# Altium schematic sheet Schematic - V1.SchDoc
size A3; SheetNumber: 1; SheetTotal: 2
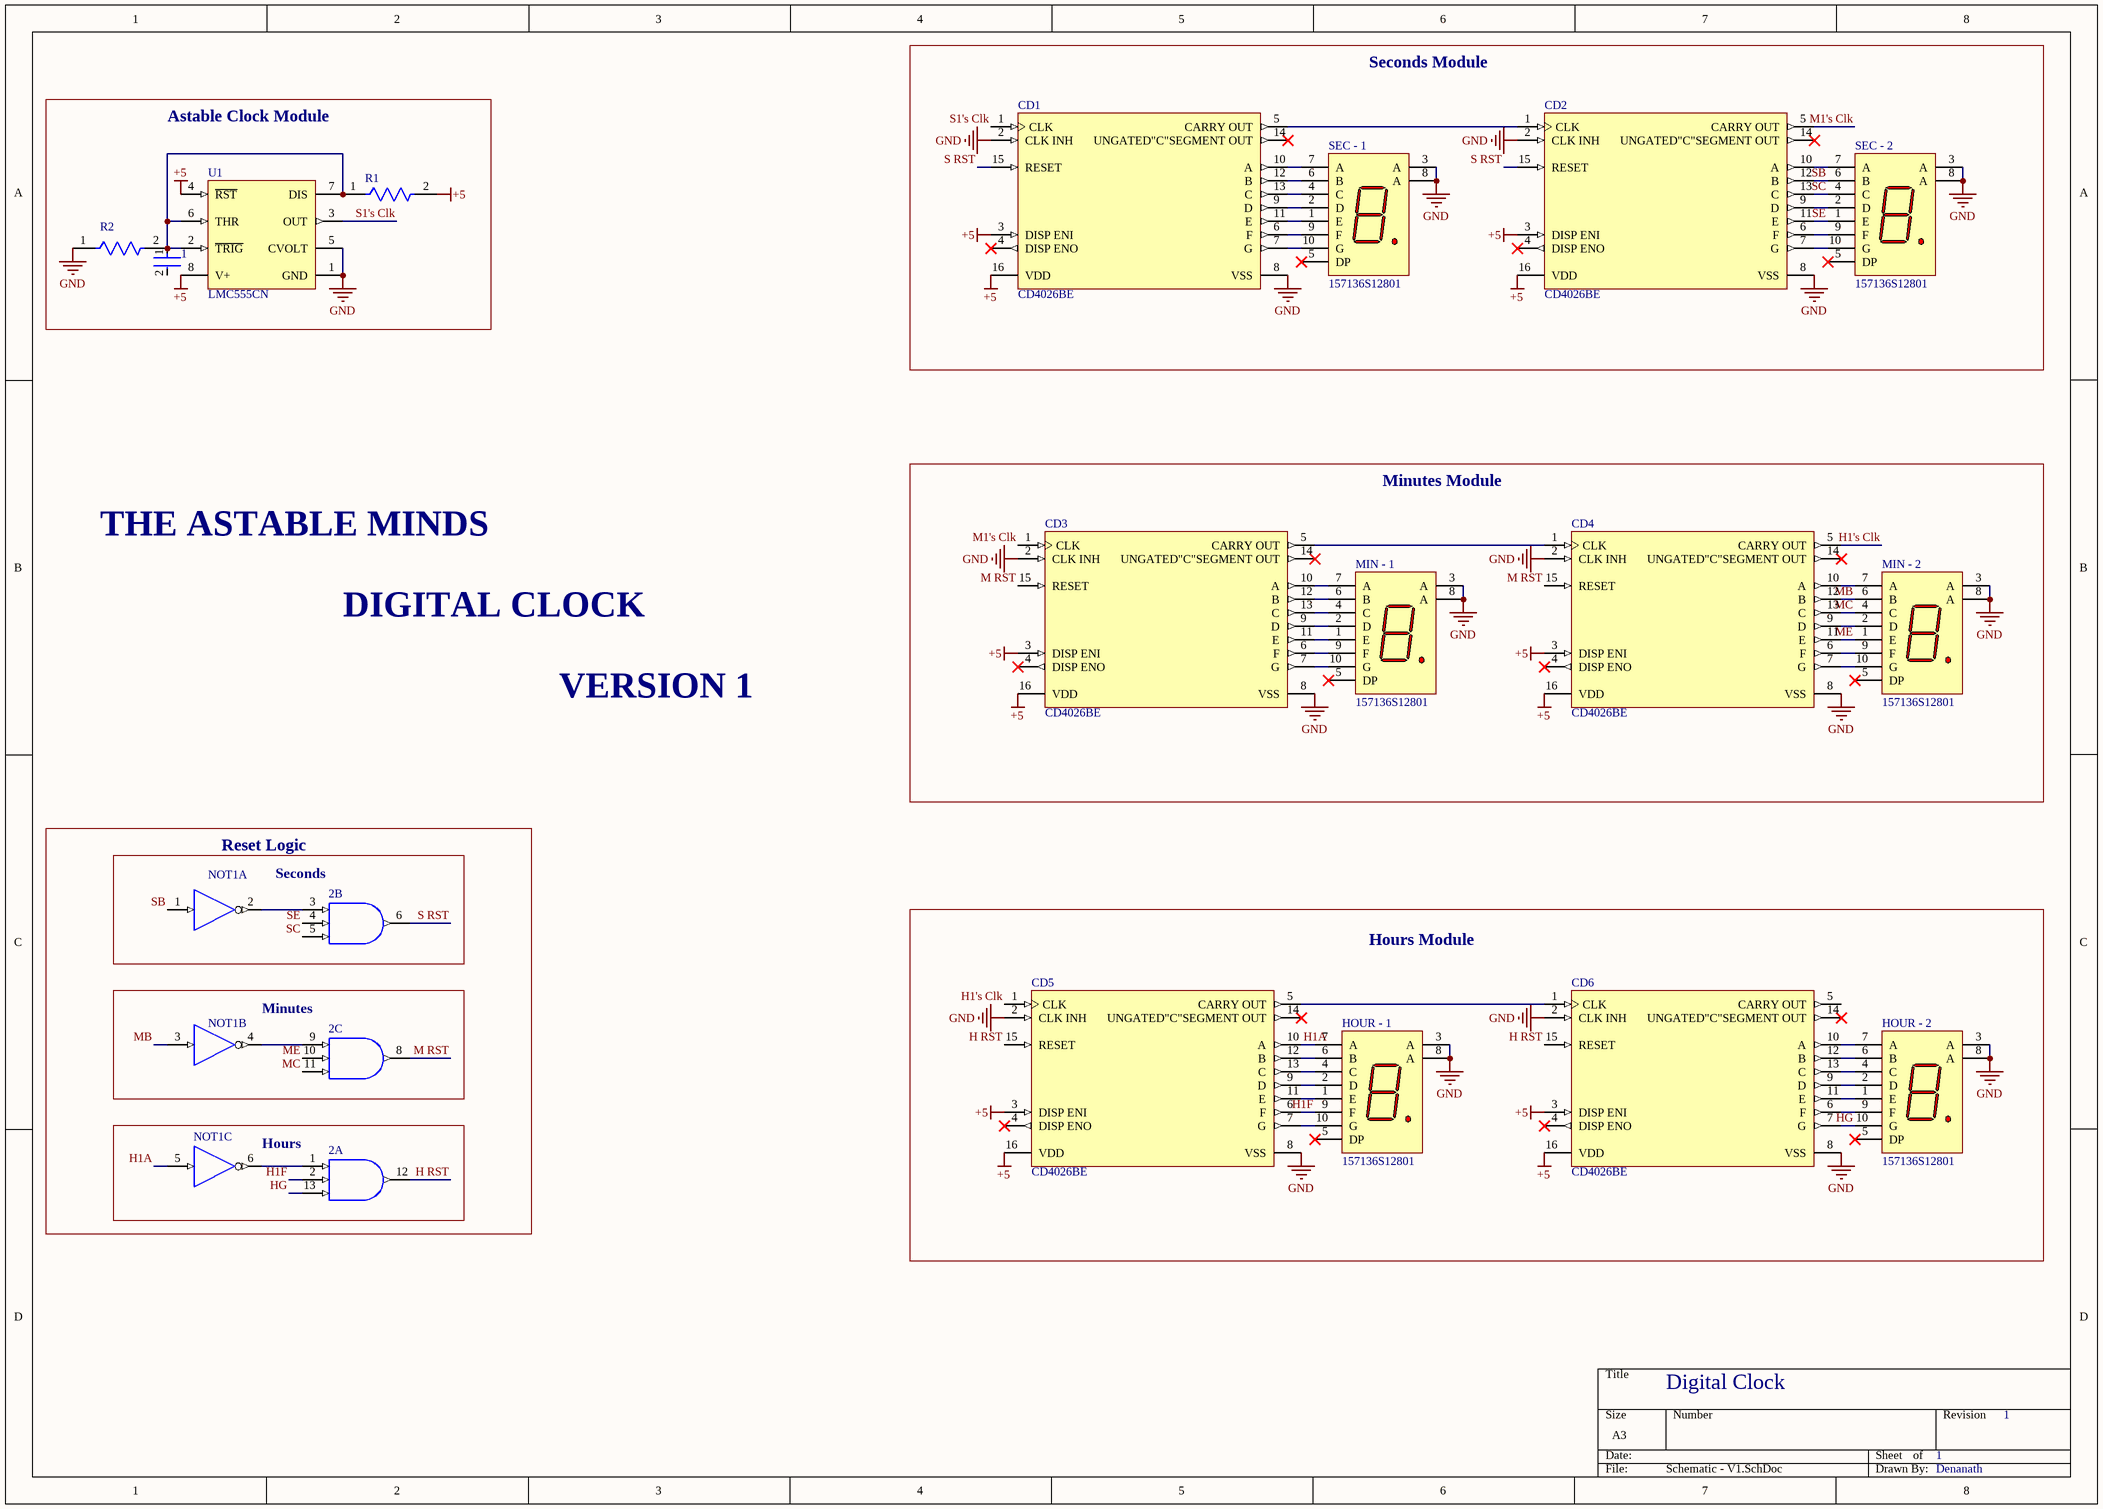
[diagram p0: Schematic - V1.SchDoc]

## Parts
1  VY1472M63Y5UQ6TV0  [FP-VY1472M63Y5UQ6TV0-MFG]  (value not drawn)
2  SN74LS11N  [N0014A]  (value not drawn)  (parts A,B,C of 4)
CD1  CD4026BE  [N0016A]
CD2  CD4026BE  [N0016A]
CD3  CD4026BE  [N0016A]
CD4  CD4026BE  [N0016A]
CD5  CD4026BE  [N0016A]
CD6  CD4026BE  [N0016A]
HOUR_-_1  157136S12801  [WL-T7DS_L17.5W12.4H7]
HOUR_-_2  157136S12801  [WL-T7DS_L17.5W12.4H7]
MIN_-_1  157136S12801  [WL-T7DS_L17.5W12.4H7]
MIN_-_2  157136S12801  [WL-T7DS_L17.5W12.4H7]
NOT1  SN74HCU04N  [N0014A]  (value not drawn)  (parts A,B,C of 7)
R1  VR37000001204JA100  [FP-VR37-MFG]  (value not drawn)
R2  VR37000001204JA100  [FP-VR37-MFG]  (value not drawn)
SEC_-_1  157136S12801  [WL-T7DS_L17.5W12.4H7]
SEC_-_2  157136S12801  [WL-T7DS_L17.5W12.4H7]
U1  LMC555CN  [P0008A]

## Blocks framed on the sheet
Seconds Module: CD1 CD2 SEC_-_1 SEC_-_2
Astable Clock Module: 1 R1 R2 U1
Minutes Module: CD3 CD4 MIN_-_1 MIN_-_2
Reset Logic: 2 NOT1
Hours Module: CD5 CD6 HOUR_-_1 HOUR_-_2
Minutes: 2 NOT1
Hours: 2 NOT1

## Nets
+5: CD1.3(DISP_ENI) CD1.16(VDD) CD2.3(DISP_ENI) CD2.16(VDD) CD3.3(DISP_ENI) CD3.16(VDD) CD4.3(DISP_ENI) CD4.16(VDD) CD5.3(DISP_ENI) CD5.16(VDD) CD6.3(DISP_ENI) CD6.16(VDD) R1.2 U1.4(~{RST}) U1.8(V+)
GND: CD1.2(CLK_INH) CD1.8(VSS) CD2.2(CLK_INH) CD2.8(VSS) CD3.2(CLK_INH) CD3.8(VSS) CD4.2(CLK_INH) CD4.8(VSS) CD5.2(CLK_INH) CD5.8(VSS) CD6.2(CLK_INH) CD6.8(VSS) HOUR_-_1.3(A) HOUR_-_1.8(A) HOUR_-_2.3(A) HOUR_-_2.8(A) MIN_-_1.3(A) MIN_-_1.8(A) MIN_-_2.3(A) MIN_-_2.8(A) R2.1 SEC_-_1.3(A) SEC_-_1.8(A) SEC_-_2.3(A) SEC_-_2.8(A) U1.1(GND) U1.5(CVOLT)
H1's Clk: CD4.5(CARRY_OUT) CD5.1(CLK)
H1A: NOT1.5(3A)
H1F: 2.2(1B) CD5.6(F) HOUR_-_1.9(F)
H RST: 2.12(1Y) CD5.15(RESET) CD6.15(RESET)
HG: 2.13(1C) CD6.7(G) HOUR_-_2.10(G)
M1's Clk: CD2.5(CARRY_OUT) CD3.1(CLK)
M RST: 2.8(3Y) CD3.15(RESET) CD4.15(RESET)
MB: CD4.12(B) MIN_-_2.6(B) NOT1.3(2A)
MC: 2.11(3C) CD4.13(C) MIN_-_2.4(C)
ME: 2.10(3B) CD4.11(E) MIN_-_2.1(E)
S1's Clk: CD1.1(CLK) U1.3(OUT)
S RST: 2.6(2Y) CD1.15(RESET) CD2.15(RESET)
SB: CD2.12(B) NOT1.1(1A) SEC_-_2.6(B)
SC: 2.5(2C) CD2.13(C) SEC_-_2.4(C)
SE: 2.4(2B) CD2.11(E) SEC_-_2.1(E)
Net1_1: 1.1 R1.1 R2.2 U1.2(~{TRIG}) U1.6(THR) U1.7(DIS)
Net2_1: 2.1(1A) NOT1.6(~{3Y})
Net2_3: 2.3(2A) NOT1.2(~{1Y})
Net2_9: 2.9(3A) NOT1.4(~{2Y})
NetCD1_5: CD1.5(CARRY_OUT) CD2.1(CLK)
NetCD1_6: CD1.6(F) SEC_-_1.9(F)
NetCD1_7: CD1.7(G) SEC_-_1.10(G)
NetCD1_9: CD1.9(D) SEC_-_1.2(D)
NetCD1_10: CD1.10(A) SEC_-_1.7(A)
NetCD1_11: CD1.11(E) SEC_-_1.1(E)
NetCD1_12: CD1.12(B) SEC_-_1.6(B)
NetCD1_13: CD1.13(C) SEC_-_1.4(C)
NetCD2_6: CD2.6(F) SEC_-_2.9(F)
NetCD2_7: CD2.7(G) SEC_-_2.10(G)
NetCD2_9: CD2.9(D) SEC_-_2.2(D)
NetCD2_10: CD2.10(A) SEC_-_2.7(A)
NetCD3_5: CD3.5(CARRY_OUT) CD4.1(CLK)
NetCD3_6: CD3.6(F) MIN_-_1.9(F)
NetCD3_7: CD3.7(G) MIN_-_1.10(G)
NetCD3_9: CD3.9(D) MIN_-_1.2(D)
NetCD3_10: CD3.10(A) MIN_-_1.7(A)
NetCD3_11: CD3.11(E) MIN_-_1.1(E)
NetCD3_12: CD3.12(B) MIN_-_1.6(B)
NetCD3_13: CD3.13(C) MIN_-_1.4(C)
NetCD4_6: CD4.6(F) MIN_-_2.9(F)
NetCD4_7: CD4.7(G) MIN_-_2.10(G)
NetCD4_9: CD4.9(D) MIN_-_2.2(D)
NetCD4_10: CD4.10(A) MIN_-_2.7(A)
NetCD5_5: CD5.5(CARRY_OUT) CD6.1(CLK)
NetCD5_7: CD5.7(G) HOUR_-_1.10(G)
NetCD5_9: CD5.9(D) HOUR_-_1.2(D)
NetCD5_10: CD5.10(A) HOUR_-_1.7(A)
NetCD5_11: CD5.11(E) HOUR_-_1.1(E)
NetCD5_12: CD5.12(B) HOUR_-_1.6(B)
NetCD5_13: CD5.13(C) HOUR_-_1.4(C)
NetCD6_6: CD6.6(F) HOUR_-_2.9(F)
NetCD6_9: CD6.9(D) HOUR_-_2.2(D)
NetCD6_10: CD6.10(A) HOUR_-_2.7(A)
NetCD6_11: CD6.11(E) HOUR_-_2.1(E)
NetCD6_12: CD6.12(B) HOUR_-_2.6(B)
NetCD6_13: CD6.13(C) HOUR_-_2.4(C)

Not connected (* = marked no-connect by the designer): 1 2; CD1 4(DISP_ENO)* 14(UNGATED"C"SEGMENT_OUT)*; CD2 4(DISP_ENO)* 14(UNGATED"C"SEGMENT_OUT)*; CD3 4(DISP_ENO)* 14(UNGATED"C"SEGMENT_OUT)*; CD4 4(DISP_ENO)* 14(UNGATED"C"SEGMENT_OUT)*; CD5 4(DISP_ENO)* 14(UNGATED"C"SEGMENT_OUT)*; CD6 4(DISP_ENO)* 5(CARRY_OUT) 14(UNGATED"C"SEGMENT_OUT)*; HOUR_-_1 5(DP)*; HOUR_-_2 5(DP)*; MIN_-_1 5(DP)*; MIN_-_2 5(DP)*; SEC_-_1 5(DP)*; SEC_-_2 5(DP)*

## Notes on the sheet
- THE ASTABLE MINDS
- DIGITAL CLOCK
- VERSION 1
- (near 2) Seconds
- Digital Clock
- 1
- Denanath
- Labels drawn without touching a wire or pin: H1A

## Library data of the parts
1 = CMP-02417-000050-1: CAP CER 4700PF 760VAC Y5U RADIAL; Voltage Rating (AC): 500V; Lead Diameter: 0.6mm; Capacitance: 4.7nF; Tolerance: 20%; Lead/Base Style: Kinked; Termination: Radial; Resistor Type: Ceramic; Radiation Hardening: No; Diameter: 16mm; Max Operating Temperature: 125°C; Case/Package: Radial; Thickness: 5mm; Lead Pitch: 10mm; Series: VY1; Contact Plating: Tin; Depth: 5mm; RoHS Compliant: Yes; Voltage: 500V; Voltage Rating (DC): 500V; Package Quantity: 500; Construction: RADIAL; Min Operating Temperature: -40°C; Height: 19mm; Height - Seated (Max): 0.787inch; Packaging: Tape and Reel; Dielectric: Y5U; Mount: Through Hole
2 = CMP-0777-00254-3: Triple 3-input positive-AND gates, N0014A, TUBE; Manufacturer: Texas Instruments; Output Type: TTL; VCC(Min)(V): 4.75; Technology Family: LS; Bits(#): 3; Voltage(Nom)(V): 5; ICC @ Nom Voltage(Max)(mA): 0.0036; Rating: Catalog; VCC(Max)(V): 5.25; tpd @ Nom Voltage(Max)(ns): 15; Output Drive (IOL/IOH)(Max)(mA): 0/8; F @ Nom Voltage(Max)(Mhz): 35; Schmitt Trigger: No; Input Type: TTL; DatasheetVersion: SDLS131; PackageReference: N0014A; Operating Temperature Range(C): 0 to 70; Generic Part Number: SN74LS11
CD1-CD6 = CMP-1623-00561-2: CMOS Decade Counter/Divider with Decoded 7-Segment Display Outputs and Display Enable, N0016A, TUBE; Manufacturer: Texas Instruments; ICC @ Nom Voltage(Max)(mA): 0.03; tpd @ Nom Voltage(Max)(ns): 250; F @ Nom Voltage(Max)(Mhz): 8; Bits(#): 7; VCC(Max)(V): 18; VCC(Min)(V): 3; Output Drive (IOL/IOH)(Max)(mA): 1.5/-1.5; Inputs: 1; Rating: Catalog; Technology Family: CD4000; Schmitt Trigger: No; Voltage(Nom)(V): 5,10,15; DatasheetVersion: SCHS031B; Operating Temperature Range(C): -55 to 125; Code_JEDEC: MS-001; Input Type: CMOS; Output Type: CMOS; Type: Decade; Generic Part Number: CD4026B; PackageReference: N0016A; Function: Counter
HOUR_-_1 HOUR_-_2 MIN_-_1 MIN_-_2 SEC_-_1 SEC_-_2 = CMP-03913-119893999-3: 7-Seg Display, Comm Anode, Super Red Rohs Compliant: Yes; Forward Voltage: 2V; Dominant Wavelength: 635nm; Max Reverse Voltage (DC): 5V; Forward Current: 100mA; Luminous Intensity: 20mcd; Width: 12.4mm; Max Operating Temperature: 85°C; Min Operating Temperature: -40°C; Height: 7mm; RoHS: Compliant; Length: 17.5mm
NOT1 = CMP-1615-00910-2: Hex Inverters, N0014A, TUBE; Manufacturer: Texas Instruments; Technology Family: HC; Bits(#): 6; Schmitt Trigger: No; Output Drive (IOL/IOH)(Max)(mA): -4/4; Input Type: CMOS; F @ Nom Voltage(Max)(Mhz): 20; VCC(Min)(V): 2; Voltage(Nom)(V): 5; ICC @ Nom Voltage(Max)(mA): 0.02; Rating: Catalog; Operating Temperature Range(C): -40 to 85; Generic Part Number: SN74HCU04; VCC(Max)(V): 6; PackageReference: N0014A; tpd @ Nom Voltage(Max)(ns): 20; Output Type: CMOS; Code_JEDEC: MS-001; DatasheetVersion: SCLS079E
R1 R2 = CMP-02408-000054-1: RES 1.2M OHM 5% 1/2W AXIAL; Voltage Rating: 3.5kV; Power Rating: 500mW; Temperature Coefficient: 200ppm/°C; Resistance: 1.2MR; Diameter: 4mm; Max Operating Temperature: 155°C; Military Standard: Not; Reach SVHC Compliant: Yes; Min Operating Temperature: -55°C; Resistance Tolerance: 5%; Resistor Type: Metal Film; Tolerance: 5%; Mount: Through Hole; Construction: Cylindrical; Contact Plating: Tin; Length: 10mm; Termination: Axial; Voltage Rating (DC): 3.5kV; Packaging: Ammo Pack; Radiation Hardening: No; Case/Package: Conformal
U1 = CMP-0056-00035-3: CMOS Timer, 8-pin MDIP; Manufacturer: Texas Instruments; PowerWise: N; CompType: Analog IC; PackageTopMarking: NSUZXYTTE#*LMC*555CN; PackageReference: P0008A; ComponentLink1Description: Datasheet URL; PinCount: 8; ComponentLink1URL: http://www.ti.com/general/docs/lit/getliterature.tsp?genericPartNumber=LMC555&fileType=pdf; PackageDescription: MDIP, .365 x .250 x .130in, 8 Lead, .100in Pitch; RoHS: N; Code_JEDEC: MS-001-BA